# Altium schematic sheet CH585M-R1.SchDoc
size 330 x 220 mm; SheetNumber: 1; SheetTotal: 1
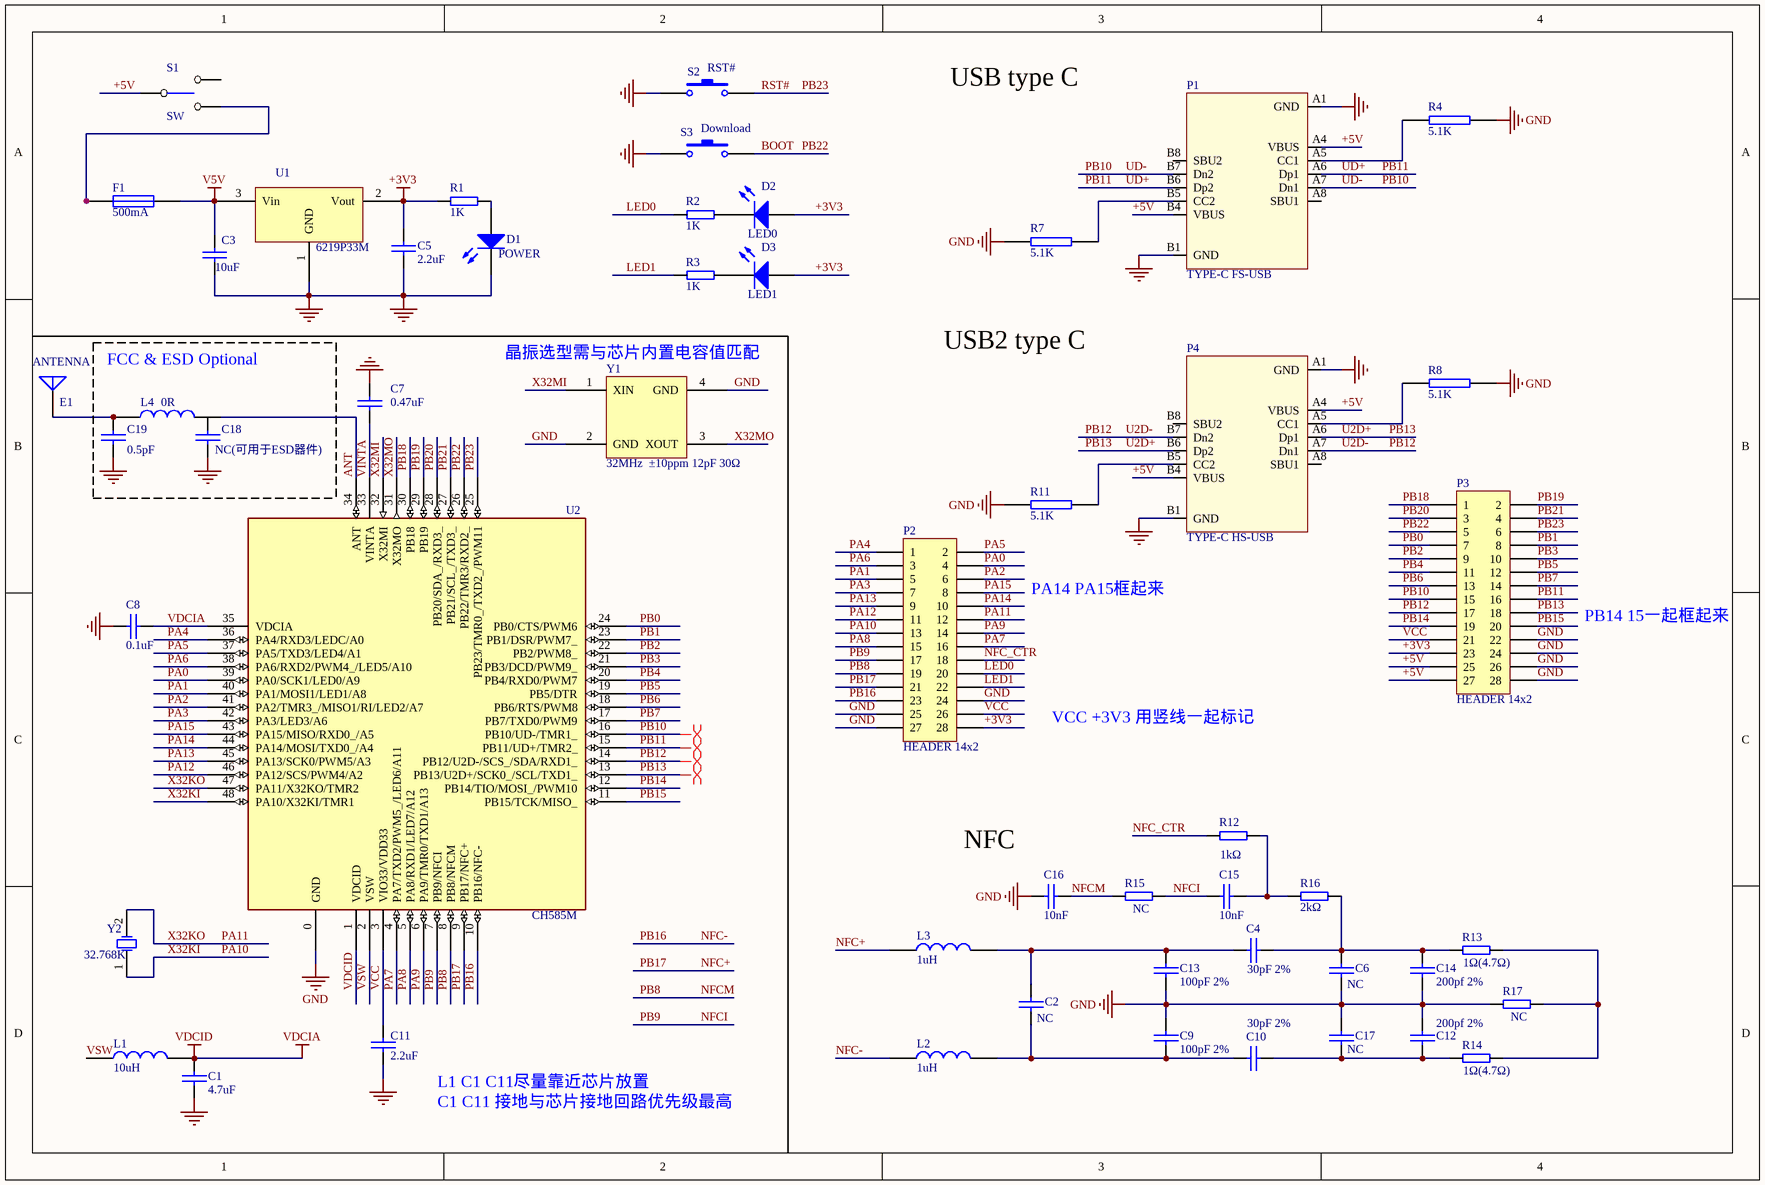
[diagram p0: CH585M-R1.SchDoc]

## Parts
C1  4.7uF  [0402_C]
C2  NC  [0402_C]
C3  10uF  [0603_C]
C4  30pF 2%  [0402_C]
C5  2.2uF  [0402_C]
C6  NC  [0402_C]
C7  0.47uF  [0402_C]
C8  0.1uF  [0402_C]
C9  100pF 2%  [0402_C]
C10  30pF 2%  [0402_C]
C11  2.2uF  [0402_C]
C12  200pf 2%  [0402_C]
C13  100pF 2%  [0402_C]
C14  200pf 2%  [0402_C]
C15  10nF  [0402_C]
C16  10nF  [0402_C]
C17  NC  [0402_C]
C18  NC(可用于ESD器件)  [0402_C]
C19  0.5pF  [0402_C]
D1  POWER  [0603+]
D2  LED0  [0603+]
D3  LED1  [0603+]
E1  ANTENNA  [ANT-F-1-2.4G-1.6mmFR4]
F1  500mA  [0603]
L1  10uH  [SMD_2x2mm]
L2  1uH  [0603]
L3  1uH  [0603]
L4  0R  [SMD_2x2mm]
P1  TYPE-C FS-USB  [TYPE-C-Receptacle-2.0]
P2  HEADER 14x2  [IDC28-2.54MM]
P3  HEADER 14x2  [IDC28-2.54MM]
P4  TYPE-C HS-USB  [TYPE-C-Receptacle-2.0]
R1  1K  [0402]
R2  1K  [0402]
R3  1K  [0402]
R4  5.1K  [0402]
R7  5.1K  [0402]
R8  5.1K  [0402]
R11  5.1K  [0402]
R12  1kΩ  [0402]
R13  1Ω(4.7Ω)  [0402]
R14  1Ω(4.7Ω)  [0402]
R15  NC  [0402]
R16  2kΩ  [0402]
R17  NC  [0402]
S1  SW  [SW1]
S2  RST#  [SMD_6.1x3.65x2.5mm-KEY]
S3  Download  [SMD_6.1x3.65x2.5mm-KEY]
U1  6219P33M  [SOT-23]
U2  CH585M  [QFN48_5X5]
Y1  32MHz  ±10ppm 12pF 30Ω  [XT3225]
Y2  32.768K  [fc-135]

## Blocks framed on the sheet
FCC & ESD Optional: C18 C19 L4

## Nets
+3V3: C5.1 D2.1(A) D3.1(A) P2.28 P3.23 R1.2 U1.2(Vout)
GND: C1.1 C3.2 C5.2 C6.1 C7.2 C8.2 C9.2 C11.1 C12.2 C13.1 C14.1 C16.2 C17.2 C18.1 C19.1 D1.2(K) P1.A1(GND) P1.B1(GND) P2.24 P2.25 P2.27 P3.22 P3.24 P3.26 P3.28 P4.A1(GND) P4.B1(GND) R4.1 R7.2 R8.1 R11.2 R17.2 S2.1 S3.1 U1.1(GND) U2.0(GND) Y1.2(GND) Y1.4(GND)
V5V: C3.1 F1.2 U1.3(Vin)
VDCIA: C1.2 C8.1 L1.2 U2.1(VDCID) U2.35(VDCIA)  [also labelled VDCID]
+5V: P1.A4(VBUS) P1.B4(VBUS) P3.25 P3.27 P4.A4(VBUS) P4.B4(VBUS) S1.1
ANT: L4.2 U2.34(ANT)
BOOT: P3.5 S3.2 U2.26(PB22/TMR3/RXD2_)  [also labelled PB22]
LED0: P2.20 R2.1
LED1: P2.22 R3.1
NFC+: L3.1 P2.21 U2.9(PB17/NFC+)  [also labelled PB17]
NFC-: L2.1 P2.23 U2.10(PB16/NFC-)  [also labelled PB16]
NFC_CTR: P2.18 R12.2
NFCI: C15.1 P2.17 R15.1 U2.7(PB9/NFCI)  [also labelled PB9]
NFCM: C16.1 P2.19 R15.2 U2.8(PB8/NFCM)  [also labelled PB8]
PA0: P2.4 U2.39(PA0/SCK1/LED0/A9)
PA1: P2.5 U2.40(PA1/MOSI1/LED1/A8)
PA2: P2.6 U2.41(PA2/TMR3_/MISO1/RI/LED2/A7)
PA3: P2.7 U2.42(PA3/LED3/A6)
PA4: P2.1 U2.36(PA4/RXD3/LEDC/A0)
PA5: P2.2 U2.37(PA5/TXD3/LED4/A1)
PA6: P2.3 U2.38(PA6/RXD2/PWM4_/LED5/A10)
PA7: P2.16 U2.4(PA7/TXD2/PWM5_/LED6/A11)
PA8: P2.15 U2.5(PA8/RXD1/LED7/A12)
PA9: P2.14 U2.6(PA9/TMR0/TXD1/A13)
PA10: P2.13 U2.48(PA10/X32KI/TMR1) Y2.1(OSC1)  [also labelled X32KI]
PA11: P2.12 U2.47(PA11/X32KO/TMR2) Y2.2(OSC2)  [also labelled X32KO]
PA12: P2.11 U2.46(PA12/SCS/PWM4/A2)
PA13: P2.9 U2.45(PA13/SCK0/PWM5/A3)
PA14: P2.10 U2.44(PA14/MOSI/TXD0_/A4)
PA15: P2.8 U2.43(PA15/MISO/RXD0_/A5)
PB0: P3.7 U2.24(PB0/CTS/PWM6)
PB1: P3.8 U2.23(PB1/DSR/PWM7_)
PB2: P3.9 U2.22(PB2/PWM8_)
PB3: P3.10 U2.21(PB3/DCD/PWM9_)
PB4: P3.11 U2.20(PB4/RXD0/PWM7)
PB5: P3.12 U2.19(PB5/DTR)
PB6: P3.13 U2.18(PB6/RTS/PWM8)
PB7: P3.14 U2.17(PB7/TXD0/PWM9)
PB10: P1.A7(Dn1) P1.B7(Dn2) P3.15 U2.16(PB10/UD-/TMR1_)  [also labelled UD-]
PB11: P1.A6(Dp1) P1.B6(Dp2) P3.16 U2.15(PB11/UD+/TMR2_)  [also labelled UD+]
PB12: P3.17 P4.A7(Dn1) P4.B7(Dn2) U2.14(PB12/U2D-/SCS_/SDA/RXD1_)  [also labelled U2D-]
PB13: P3.18 P4.A6(Dp1) P4.B6(Dp2) U2.13(PB13/U2D+/SCK0_/SCL/TXD1_)  [also labelled U2D+]
PB14: P3.19 U2.12(PB14/TIO/MOSI_/PWM10)
PB15: P3.20 U2.11(PB15/TCK/MISO_)
PB18: P3.1 U2.30(PB18)
PB19: P3.2 U2.29(PB19)
PB20: P3.3 U2.28(PB20/SDA_/RXD3_)
PB21: P3.4 U2.27(PB21/SCL_/TXD3_)
PB23: P3.6 S2.2 U2.25(PB23/TMR0_/TXD2_/PWM11)  [also labelled RST#]
VCC: C11.2 P2.26 P3.21 U2.3(VIO33/VDD33)
VINTA: C7.1 U2.33(VINTA)
VSW: L1.1 U2.2(VSW)
X32MI: U2.32(X32MI) Y1.1(XIN)
X32MO: U2.31(X32MO) Y1.3(XOUT)
NetC2_1: C2.1 C9.1 C10.1 L2.2
NetC2_2: C2.2 C4.1 C13.2 L3.2
NetC4_2: C4.2 C6.2 C14.2 R13.1 R16.1
NetC10_2: C10.2 C12.1 C17.1 R14.1
NetC15_2: C15.2 R12.1 R16.2
NetC19_2: C19.2 E1.1(A) L4.1
NetD1_1: D1.1(A) R1.1
NetD2_2: D2.2(K) R2.2
NetD3_2: D3.2(K) R3.2
NetF1_1: F1.1 S1.2
NetP1_A5: P1.A5(CC1) R4.2
NetP1_B5: P1.B5(CC2) R7.1
NetP4_A5: P4.A5(CC1) R8.2
NetP4_B5: P4.B5(CC2) R11.1
NetR13_2: R13.2 R14.2 R17.1

Not connected (* = marked no-connect by the designer): C18 2; P1 A8(SBU1) B8(SBU2); P4 A8(SBU1) B8(SBU2); S1 3

## Layout directives
differential pair: PB10, PB11, PB12, PB13

## Notes on the sheet
- USB type C
- (near Y1) 晶振选型需与芯片内置电容值匹配
- USB2 type C
- PA14 PA15框起来
- PB14 15一起框起来
- VCC +3V3 用竖线一起标记
- NFC
- L1 C1 C11尽量靠近芯片放置
- C1 C11 接地与芯片接地回路优先级最高

## Library data of the parts
C1-C19 = CAP: Capacitor
D1-D3 = LED0: Typical INFRARED GaAs LED; Published: 8-Jun-2000; LatestRevisionDate: 08-Jul-2005; LatestRevisionNote: Mech Layer 1 removed.; PackageReference: LED-0; Publisher: Altium Limited
E1 = ANTENNA: Generic Antenna
F1 = FUSE1: Fuse
L1-L4 = INDUCTOR
P1 P4 = TYPE-C-Receptacle-2.0: Type-C USB2.0 母座
P2 P3 = HEADER 14x2: Header, 14-Pin, Dual row
R1-R3 R12-R17 = RES
R4 R7 R8 R11 = RES2
S2 S3 = SW-PB: Switch; Published: 24-Mar-1999; LatestRevisionDate: 17-Jul-2002; LatestRevisionNote: Re-released for DXP Platform.; PackageReference: SPST-2; Publisher: Altium Limited; PackageDescription: Switch; 2 Leads
U2 = CH585M: RISC-V MCU with BLE/HSUSB/USB/NFC/ADC/PWM/2*SPI/I2C/4*UART/LCD
Y1 = 晶体
Y2 = XTAL: Crystal Oscillator; Published: 8-Jun-2000; LatestRevisionDate: 17-Jul-2002; LatestRevisionNote: Re-released for DXP Platform.; PackageReference: R38; Publisher: Altium Limited; PackageDescription: Crystal, Thru-Hole; 2 Leads; Body 3.1 x 8.2 mm (Dia.xH)